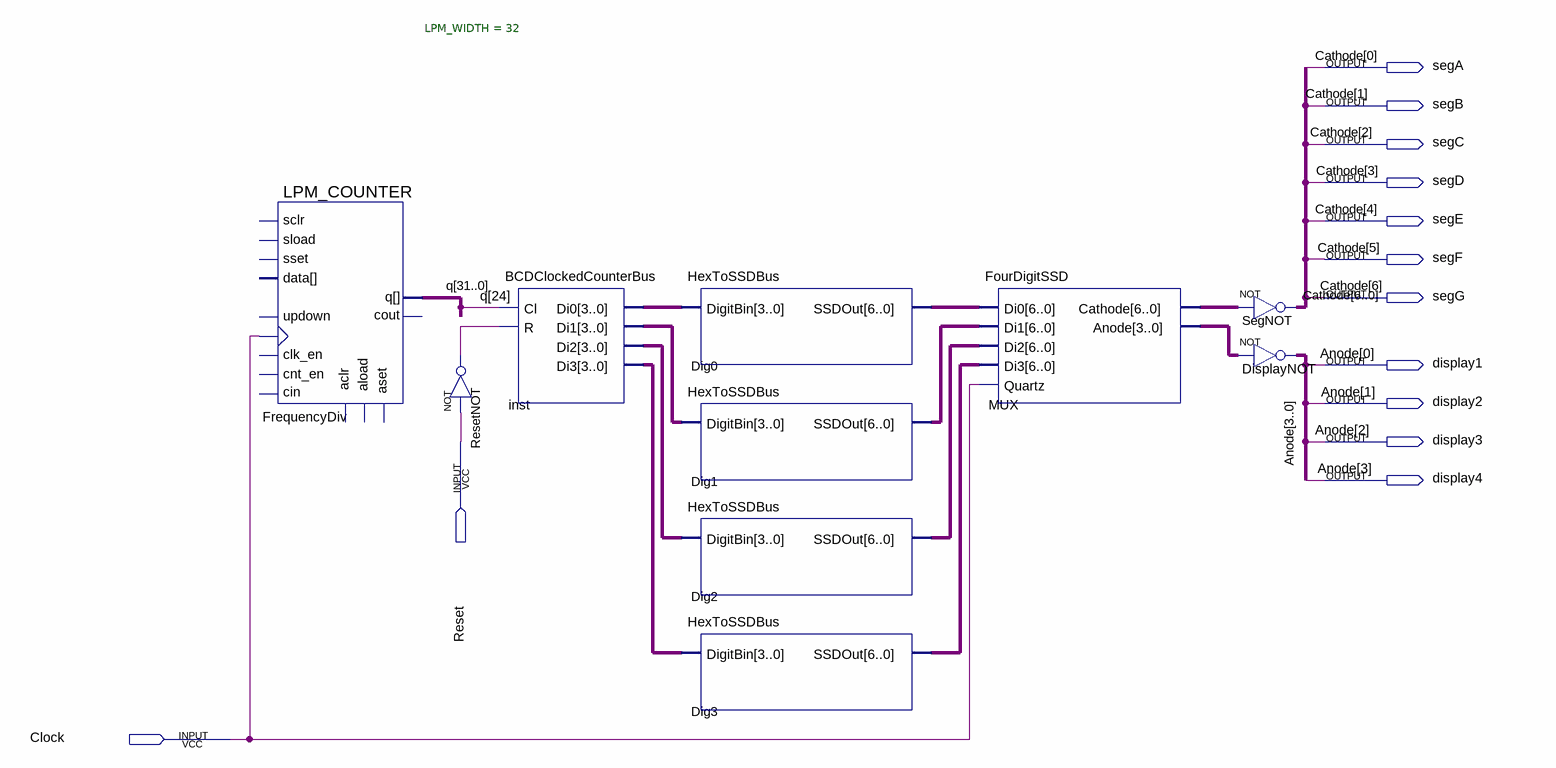
[diagram p0: schematic sheet]
// Quartus schematic FPGABCD.bdf as structural Verilog: 10 symbols, 13 pins
module FPGABCD (
  input  Reset,
  input  Clock,
  output segA,
  output segB,
  output segC,
  output segD,
  output segE,
  output segF,
  output segG,
  output display1,
  output display2,
  output display3,
  output display4
);

  wire ResetNOT_out;
  wire [3:0] inst_di0, inst_di1, inst_di2, inst_di3, MUX_anode;
  wire [6:0] Dig0_ssdout, Dig1_ssdout, Dig2_ssdout, Dig3_ssdout, MUX_cathode;
  wire [31:0] q;

  LPM_COUNTER #(.LPM_WIDTH(32)) FrequencyDiv (
    .clock(Clock), .q(q));  // open: sload, data, clk_en, aload, aclr, aset, cin, sset, updown, cnt_en, sclr, cout
  not ResetNOT (ResetNOT_out, Reset);
  BCDClockedCounterBus inst (
    .Cl(q[24]), .R(ResetNOT_out), .Di0(inst_di0), .Di1(inst_di1), .Di2(inst_di2), .Di3(inst_di3));
  HexToSSDBus Dig0 (.DigitBin(inst_di0), .SSDOut(Dig0_ssdout));
  HexToSSDBus Dig1 (.DigitBin(inst_di1), .SSDOut(Dig1_ssdout));
  HexToSSDBus Dig2 (.DigitBin(inst_di2), .SSDOut(Dig2_ssdout));
  HexToSSDBus Dig3 (.DigitBin(inst_di3), .SSDOut(Dig3_ssdout));
  FourDigitSSD MUX (
    .Di0(Dig0_ssdout), .Di1(Dig1_ssdout), .Di2(Dig2_ssdout), .Di3(Dig3_ssdout), .Quartz(Clock),
    .Cathode(MUX_cathode), .Anode(MUX_anode));
  assign {segG, segF, segE, segD, segC, segB, segA} = ~MUX_cathode;  // NOT SegNOT, 7 bits wide
  assign {display4, display3, display2, display1} = ~MUX_anode;  // NOT DisplayNOT, 4 bits wide

  // Other names for the same wires on the sheet: Anode[3:0] = {display4, display3, display2, display1};
  //   Cathode[6:0] = {segG, segF, segE, segD, segC, segB, segA}
endmodule
